# Altium project IOT_Masterv1.PrjPcb
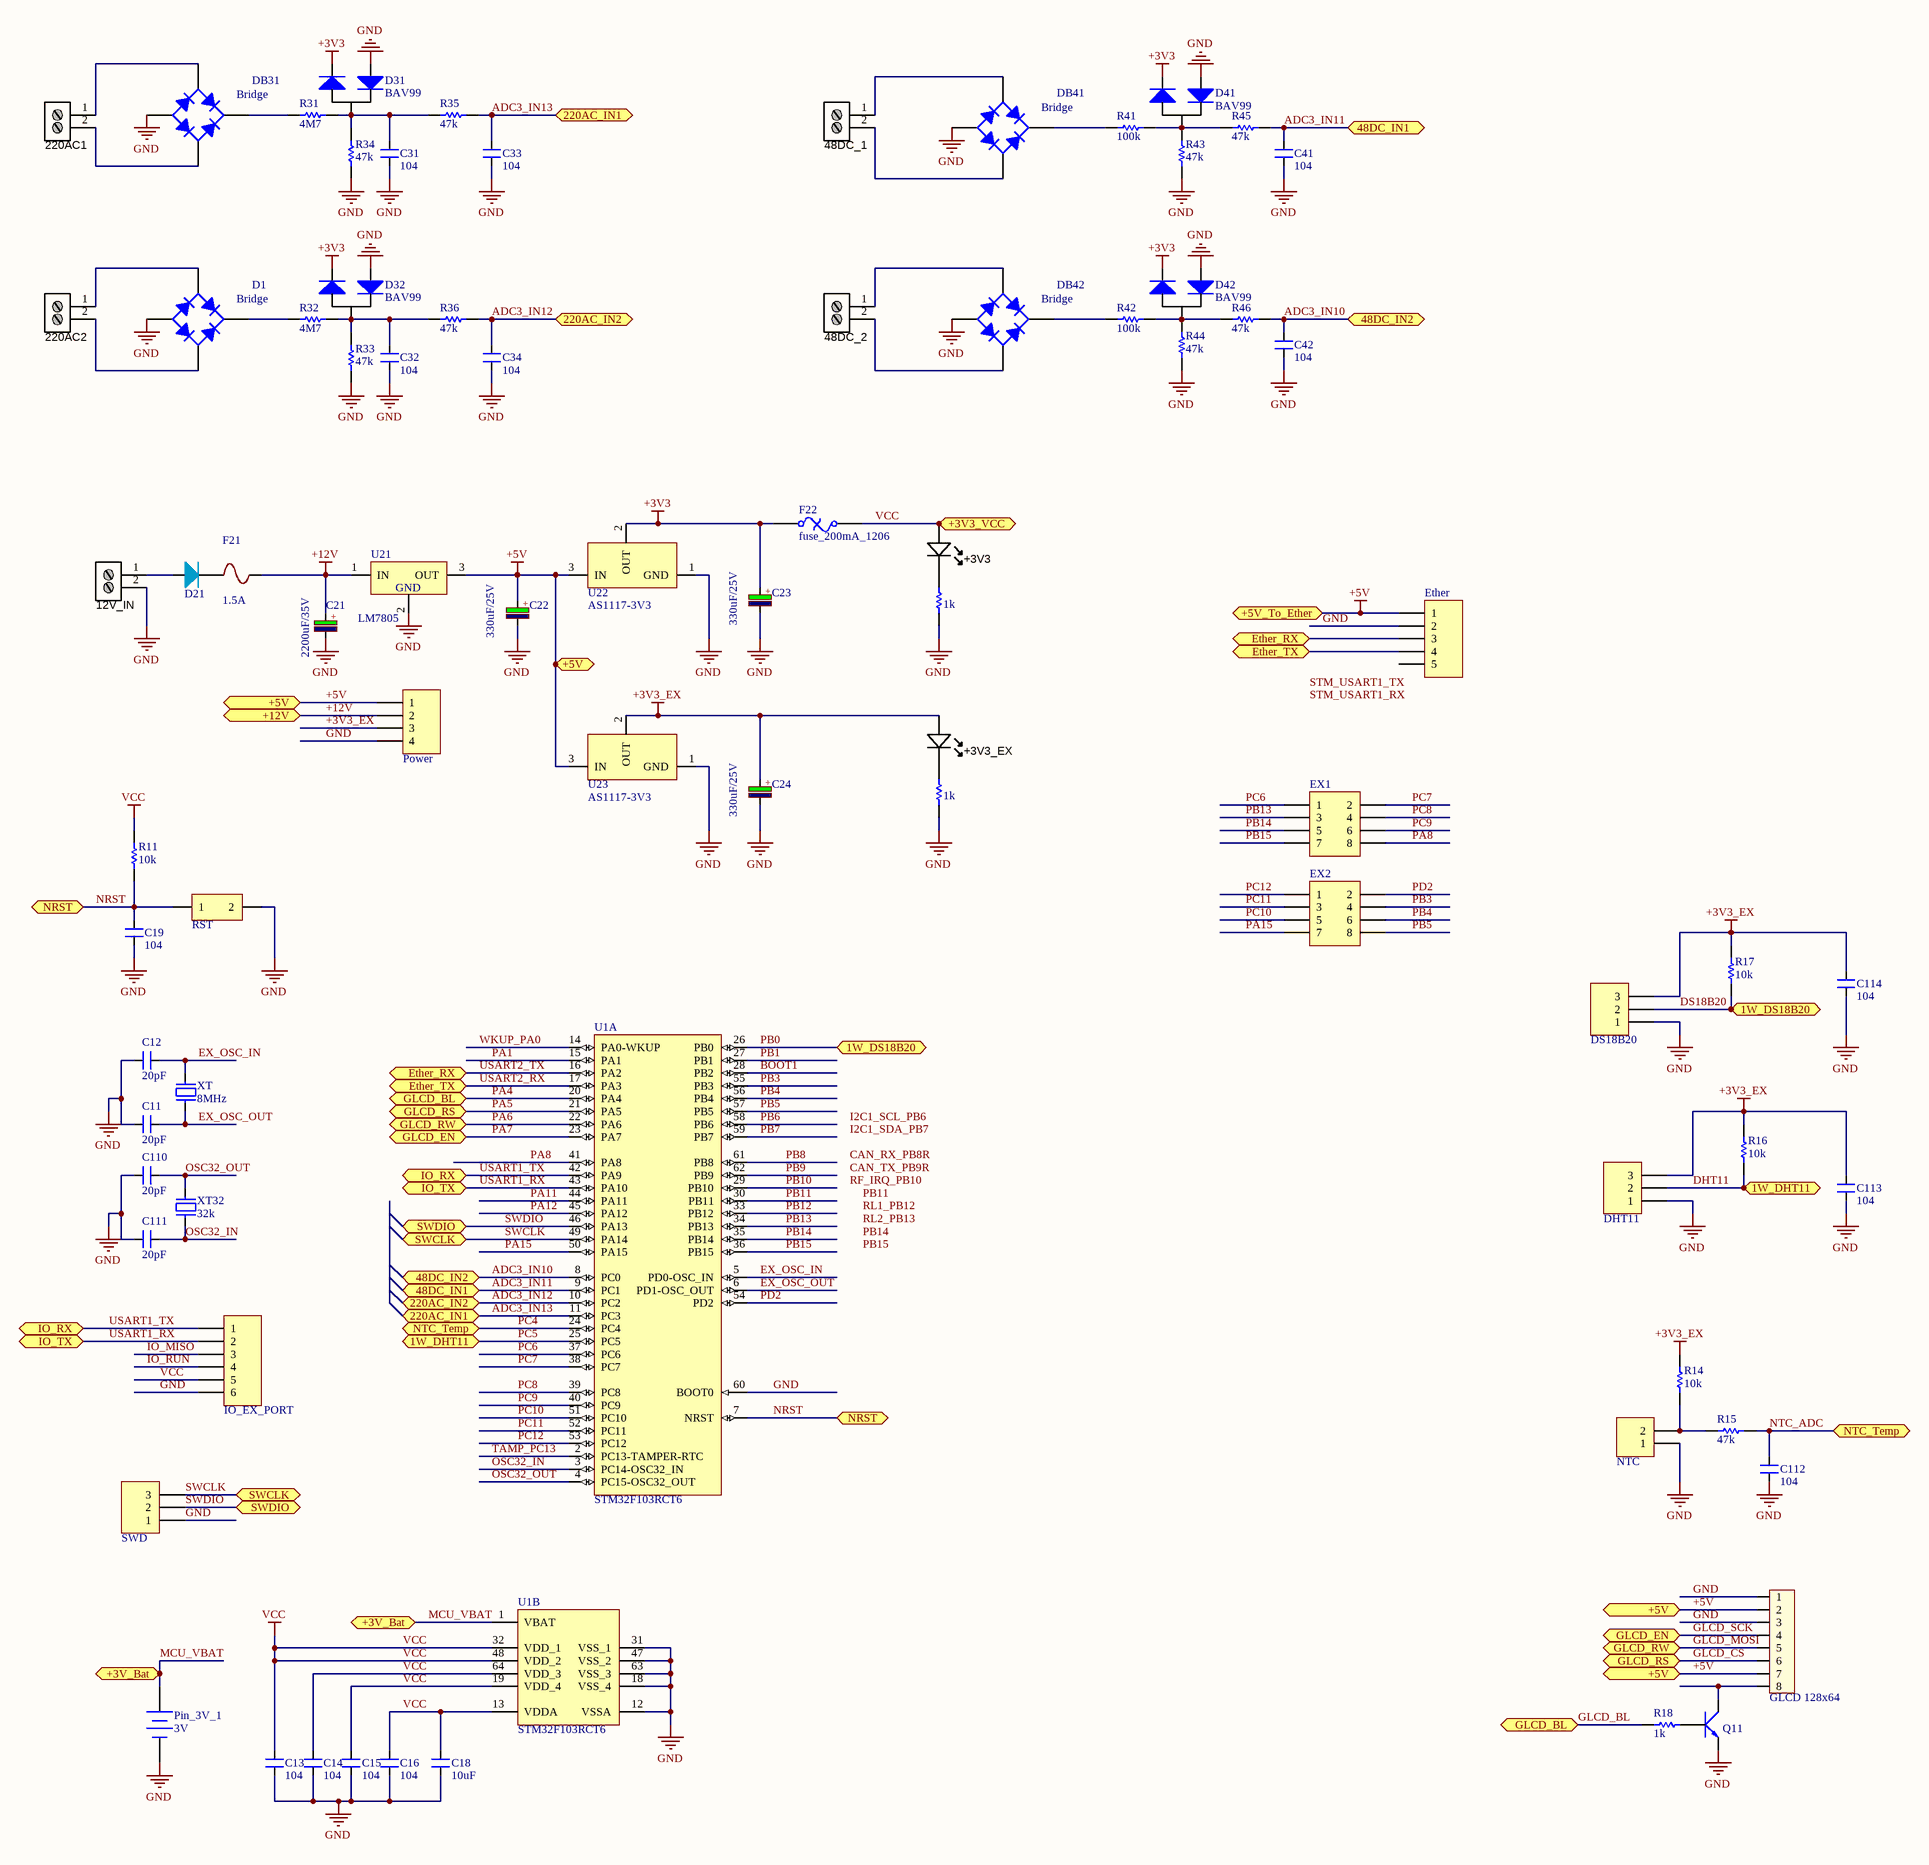
[diagram p0: IOT_Masterv1.SchDoc]
1 sheet, 80 parts. Net scope: flat (ports and power ports of the same name join across sheets).
Board file: IOT_Masterv1.PcbDoc

## Sheet IOT_Masterv1.SchDoc
size A2

### Parts
12V_IN  Stackable ScrewTerm  [2P_PCB_ScrewTerm_200mil]  (value not drawn)
48DC_1  Stackable ScrewTerm  [2P_PCB_ScrewTerm_200mil]  (value not drawn)
48DC_2  Stackable ScrewTerm  [2P_PCB_ScrewTerm_200mil]  (value not drawn)
220AC1  Stackable ScrewTerm  [2P_PCB_ScrewTerm_200mil]  (value not drawn)
220AC2  Stackable ScrewTerm  [2P_PCB_ScrewTerm_200mil]  (value not drawn)
+3V3  Blue  [LED-0805-K]  (value not drawn)
+3V3_EX  Blue  [LED-0805-K]  (value not drawn)
C11  value 20pF  [CAPC1608N]  (hidden comment: Cap_22p_0603)
C12  value 20pF  [CAPC1608N]  (hidden comment: Cap_22p_0603)
C13  value 104  [CAPC1608N]  (hidden comment: Cap_104_0603)
C14  value 104  [CAPC1608N]  (hidden comment: Cap_104_0603)
C15  value 104  [CAPC1608N]  (hidden comment: Cap_104_0603)
C16  value 104  [CAPC1608N]  (hidden comment: Cap_104_0603)
C18  value 10uF  [CAPC2012N_F]  (hidden comment: Cap_10uF_0805)
C19  value 104  [CAPC1608N]  (hidden comment: Cap_104_0603)
C21  2200uF/35V  [CP_1000uF_25V]
C22  330uF/25V  [CP1.5/3.4]
C23  330uF/25V  [CP1.5/3.4]
C24  330uF/25V  [CP1.5/3.4]
C31  value 104  [CAPC2012N_F]  (hidden comment: CAP NP)
C32  value 104  [CAPC2012N_F]  (hidden comment: CAP NP)
C33  value 104  [CAPC1608N]  (hidden comment: CAP NP)
C34  value 104  [CAPC1608N]  (hidden comment: CAP NP)
C41  value 104  [CAPC1608N]  (hidden comment: CAP NP)
C42  value 104  [CAPC1608N]  (hidden comment: CAP NP)
C110  value 20pF  [CAPC1608N]  (hidden comment: Cap_22p_0603)
C111  value 20pF  [CAPC1608N]  (hidden comment: Cap_22p_0603)
C112  value 104  [CAPC1608N]  (hidden comment: CAP NP)
C113  value 104  [CAPC1608N]  (hidden comment: CAP NP)
C114  value 104  [CAPC1608N]  (hidden comment: CAP NP)
D1  Bridge  [MB6S]
D21  Diode  [DO-214AC]  (value not drawn)
D31  BAV99  [SOT323]
D32  BAV99  [SOT323]
D41  BAV99  [SOT323]
D42  BAV99  [SOT323]
DB31  Bridge  [MB6S]
DB41  Bridge  [MB6S]
DB42  Bridge  [MB6S]
DHT11  Header 3  [HDR1X3]  (value not drawn)
DS18B20  Header 3  [HDR1X3]  (value not drawn)
Ether  EX_CON  [HDR1X5H]  (value not drawn)
EX1  Header 4X2  [HDR2X4]  (value not drawn)
EX2  Header 4X2  [HDR2X4]  (value not drawn)
F21  1.5A  [FUSE_SR-5-BK]
F22  fuse_200mA_1206  [SMD 1206]
GLCD_128x64  JP8  [CON8]  (value not drawn)
IO_EX_PORT  Header 6  [HDR1X6]  (value not drawn)
NTC  NTC_10K  [HDR1X2]  (value not drawn)
Pin_3V_1  3V  [CR1220]
Power  Header 4  [HDR1X4]  (value not drawn)
Q11  C828  [SOT23 TOP]  (value not drawn)
R11  value 10k  [RESC1608N_F]  (hidden comment: Res_10k_0603)
R14  value 10k  [RESC1608N_ZERO]  (hidden comment: Res)
R15  value 47k  [RESC2012N_F]  (hidden comment: Res)
R16  value 10k  [RESC1608N_ZERO]  (hidden comment: Res)
R17  value 10k  [RESC1608N_ZERO]  (hidden comment: Res)
R18  value 1k  [RESC1608N_ZERO]  (hidden comment: Res)
R21  value 1k  [RESC2012N_F]  (hidden comment: Res_0805_1k)
R22  value 1k  [RESC2012N_F]  (hidden comment: Res_0805_1k)
R31  value 4M7  [RESTH_0.0R_AXIAL-0.6]  (hidden comment: Res)
R32  value 4M7  [RESTH_0.0R_AXIAL-0.6]  (hidden comment: Res)
R33  value 47k  [RESTH_0.0R_AXIAL-0.6]  (hidden comment: Res)
R34  value 47k  [RESTH_0.0R_AXIAL-0.6]  (hidden comment: Res)
R35  value 47k  [RESC2012N_F]  (hidden comment: Res)
R36  value 47k  [RESC2012N_F]  (hidden comment: Res)
R41  value 100k  [RESTH_0.0R_AXIAL-0.6]  (hidden comment: Res)
R42  value 100k  [RESTH_0.0R_AXIAL-0.6]  (hidden comment: Res)
R43  value 47k  [RESTH_0.0R_AXIAL-0.6]  (hidden comment: Res)
R44  value 47k  [RESTH_0.0R_AXIAL-0.6]  (hidden comment: Res)
R45  value 47k  [RESC2012N_F]  (hidden comment: Res)
R46  value 47k  [RESC2012N_F]  (hidden comment: Res)
RST  Button  [SW]  (value not drawn)
SWD  Header 3  [HDR1X3]  (value not drawn)
U1  STM32F103RCT6  [STM-LQFP64_N]  (parts A,B of 2)
U21  LM7805  [TO-220]
U22  AS1117-3V3  [SOT223-4N]
U23  AS1117-3V3  [SOT223-4N]
XT  8MHz  [XT2]
XT32  32k  [XTminiv2]

### Ports
1W_DHT11, 1W_DS18B20, 48DC_IN1, 48DC_IN2, 220AC_IN1, 220AC_IN2, +3V3_VCC, +3V_Bat, +5V, +5V_To_Ether, +12V, Ether_RX, Ether_TX, GLCD_BL, GLCD_EN, GLCD_RS, GLCD_RW, IO_RX, IO_TX, NRST, NTC_Temp, SWCLK, SWDIO

### Nets
+3V3: C23.1 D31.2(K) D32.2(K) D41.2(K) D42.2(K) F22.1 U22.2(OUT)
+3V3_EX: +3V3_EX.A C24.1 C113.2 C114.2 DHT11.3 DS18B20.3 Power.3 R14.2 R16.2 R17.2 U23.2(OUT)
+5V: C22.1 Ether.1 GLCD_128x64.2 GLCD_128x64.7 Power.1 U21.3(OUT) U22.3(IN) U23.3(IN) ; port +5V, port +5V_To_Ether
+12V: C21.1 F21.2 Power.2 U21.1(IN) ; port +12V
GND: 12V_IN.2 C11.2 C12.2 C13.1 C14.1 C15.1 C16.1 C18.1 C19.1 C21.2 C22.2 C23.2 C24.2 C31.1 C32.1 C33.1 C34.1 C41.1 C42.1 C110.2 C111.2 C112.1 C113.1 C114.1 D1.3(A) D31.1(A) D32.1(A) D41.1(A) D42.1(A) DB31.3(A) DB41.3(A) DB42.3(A) DHT11.1 DS18B20.1 Ether.2 GLCD_128x64.1 GLCD_128x64.3 IO_EX_PORT.6 NTC.1 Pin_3V_1.2(-) Power.4 Q11.3(E) R21.2 R22.2 R33.1 R34.1 R43.1 R44.1 RST.2 SWD.1 U1.12(VSSA) U1.18(VSS_4) U1.31(VSS_1) U1.47(VSS_2) U1.60(BOOT0) U1.63(VSS_3) U21.2 U22.1(GND) U23.1(GND)
VCC: +3V3.A C13.2 C14.2 C15.2 C16.2 C18.2 F22.2 IO_EX_PORT.5 R11.2 U1.13(VDDA) U1.19(VDD_4) U1.32(VDD_1) U1.48(VDD_2) U1.64(VDD_3) ; port +3V3_VCC
ADC3_IN10: C42.2 R46.2 U1.8(PC0) ; port 48DC_IN2
ADC3_IN11: C41.2 R45.2 U1.9(PC1) ; port 48DC_IN1
ADC3_IN12: C34.2 R36.2 U1.10(PC2) ; port 220AC_IN2
ADC3_IN13: C33.2 R35.2 U1.11(PC3) ; port 220AC_IN1
BOOT1: U1.28(PB2)
DHT11: DHT11.2 R16.1 U1.25(PC5) ; port 1W_DHT11  [also labelled PC5]
DS18B20: DS18B20.2 R17.1 U1.26(PB0) ; port 1W_DS18B20  [also labelled PB0]
EX_OSC_IN: C12.1 U1.5(PD0-OSC_IN) XT.2
EX_OSC_OUT: C11.1 U1.6(PD1-OSC_OUT) XT.1
GLCD_BL: R18.1 U1.20(PA4) ; port GLCD_BL  [also labelled PA4]
GLCD_CS: GLCD_128x64.6 U1.21(PA5) ; port GLCD_RS  [also labelled PA5]
GLCD_MOSI: GLCD_128x64.5 U1.22(PA6) ; port GLCD_RW  [also labelled PA6]
GLCD_SCK: GLCD_128x64.4 U1.23(PA7) ; port GLCD_EN  [also labelled PA7]
IO_MISO: IO_EX_PORT.3
IO_RUN: IO_EX_PORT.4
MCU_VBAT: Pin_3V_1.1(+) U1.1(VBAT) ; port +3V_Bat
NRST: C19.2 R11.1 RST.1 U1.7(NRST) ; port NRST
NTC_ADC: C112.2 R15.2 U1.24(PC4) ; port NTC_Temp  [also labelled PC4]
OSC32_IN: C111.1 U1.3(PC14-OSC32_IN) XT32.1
OSC32_OUT: C110.1 U1.4(PC15-OSC32_OUT) XT32.2
PA1: U1.15(PA1)
PA8: EX1.8 U1.41(PA8)
PA11: U1.44(PA11)
PA12: U1.45(PA12)
PA15: EX2.7 U1.50(PA15)
PB1: U1.27(PB1)
PB3: EX2.4 U1.55(PB3)
PB4: EX2.6 U1.56(PB4)
PB5: EX2.8 U1.57(PB5)
PB6: U1.58(PB6)
PB7: U1.59(PB7)
PB8: U1.61(PB8)
PB9: U1.62(PB9)
PB10: U1.29(PB10)
PB11: U1.30(PB11)
PB12: U1.33(PB12)
PB13: EX1.3 U1.34(PB13)
PB14: EX1.5 U1.35(PB14)
PB15: EX1.7 U1.36(PB15)
PC6: EX1.1 U1.37(PC6)
PC7: EX1.2 U1.38(PC7)
PC8: EX1.4 U1.39(PC8)
PC9: EX1.6 U1.40(PC9)
PC10: EX2.5 U1.51(PC10)
PC11: EX2.3 U1.52(PC11)
PC12: EX2.1 U1.53(PC12)
PD2: EX2.2 U1.54(PD2)
SWCLK: SWD.3 U1.49(PA14) ; port SWCLK
SWDIO: SWD.2 U1.46(PA13) ; port SWDIO
TAMP_PC13: U1.2(PC13-TAMPER-RTC)
USART1_RX: IO_EX_PORT.2 U1.43(PA10) ; port IO_TX
USART1_TX: IO_EX_PORT.1 U1.42(PA9) ; port IO_RX
USART2_RX: Ether.4 U1.17(PA3) ; port Ether_TX
USART2_TX: Ether.3 U1.16(PA2) ; port Ether_RX
WKUP_PA0: U1.14(PA0-WKUP)
Net12V_IN_1: 12V_IN.1 D21.1(A)
Net48DC_1_1: 48DC_1.1 DB41.4(C)
Net48DC_1_2: 48DC_1.2 DB41.2(C)
Net48DC_2_1: 48DC_2.1 DB42.4(C)
Net48DC_2_2: 48DC_2.2 DB42.2(C)
Net220AC1_1: 220AC1.1 DB31.4(C)
Net220AC1_2: 220AC1.2 DB31.2(C)
Net220AC2_1: 220AC2.1 D1.4(C)
Net220AC2_2: 220AC2.2 D1.2(C)
Net+3V3_EX_K: +3V3_EX.K R22.1
Net+3V3_K: +3V3.K R21.1
NetC31_2: C31.2 D31.3(AK) R31.2 R34.2 R35.1
NetC32_2: C32.2 D32.3(AK) R32.2 R33.2 R36.1
NetD1_1: D1.1(K) R32.1
NetD21_2: D21.2(K) F21.1
NetD41_3: D41.3(AK) R41.2 R43.2 R45.1
NetD42_3: D42.3(AK) R42.2 R44.2 R46.1
NetDB31_1: DB31.1(K) R31.1
NetDB41_1: DB41.1(K) R41.1
NetDB42_1: DB42.1(K) R42.1
NetGLCD_128x64_8: GLCD_128x64.8 Q11.2(C)
NetNTC_2: NTC.2 R14.1 R15.1
NetQ11_1: Q11.1(B) R18.2

Not connected (* = marked no-connect by the designer): Ether 5

### Notes on the sheet
- Labels drawn without touching a wire or pin: CAN_RX_PB8R, CAN_TX_PB9R, I2C1_SCL_PB6, I2C1_SDA_PB7, PB11, PB14, PB15, RF_IRQ_PB10, RL1_PB12, RL2_PB13, STM_USART1_RX, STM_USART1_TX
- (in symbol CP4) +
- (in symbol LM78xx) GND

### Library data of the parts
12V_IN 48DC_1 48DC_2 220AC1 220AC2 = 2P_ScrewTerm_90S_3.81MM: Terminal Block Screw Type THT 2-Position 3.81mm pitch; Manufacturer 1: Tyco Electronics; Manufacturer Part Number 1: 1776113-2; Value: 2 position; Pitch: 0.150" (3.81mm); Positions Per Level: 2; Package / Case: Side Entry; 3.81mm pitch; Category: Connectors Interconnects; Color: Black; Supplier 1: Digi-Key; Supplier Part Number 1: A97976-ND
+3V3 +3V3_EX = LED_SMD_Blue_0805_100mcd: LED 0805 SMD Blue 100mcd 470nm; Manufacturer 1: Ligitek; Manufacturer Part Number 1: LG-170DBKZ-CT; Ratings: 100 mcd; 470 nm; Package / Case: 0805; Material: InGaN/GaN; Value: Blue; Color: Blue
C11-C16 C18 C19 C110 C111 = CAP NP
C21-C24 = CP4: Cap 1000uF/16V - 220uF/50V; Description 5: 4,7uF>10uF/250V_3,3uF>10uF/400V - 2,2uF>4,7uF/450V; Description 1: 2200uF-3300uF/6,3V - 1000uF-2200uF/10V; Description 2: 1000uF/16V - 470uF => 1000uF/25V - 100uF/100V; Description 3: 330uF>470uF/35V_220uF>470uF/50V_10uF>22uF/250V; Description 4: 220uF => 330uF/63V - 10uF =>33uF/160 - 200V; Value: 1000uF/16V
D1 DB31 DB41 DB42 = Bridge1: Full Wave Diode Bridge; pin to pad: 2>3 3>4 4>2; Published: 8-Jun-2000; LatestRevisionDate: 29-May-2009; LatestRevisionNote: Sch pins A & K swapped.; DatasheetVersion: E2732B; PackageReference: D-38; Publisher: Altium Limited; PackageDescription: Bridge Rectifier; 4 Terminals; Body 9.4 x 9.4 mm (typ); Pitch 5.08 mm
D21 = Diode: pin to pad: 1>A 2>K
D31 D32 D41 D42 = BAV99W
DHT11 DS18B20 SWD = Header 3: Header, 3-Pin; LatestRevisionDate: 17-Jul-2002; LatestRevisionNote: Re-released for DXP Platform.; Publisher: Altium Limited
Ether = Header 5H: Header, 5-Pin, Right Angle; LatestRevisionDate: 17-Jul-2002; LatestRevisionNote: Re-released for DXP Platform.; Publisher: Altium Limited
EX1 EX2 = Header 4X2: Header, 4-Pin, Dual row; LatestRevisionDate: 17-Jul-2002; LatestRevisionNote: Re-released for DXP Platform.; Publisher: Altium Limited
F21 = Fuse
F22 = Fuse Thermal: Thermal Fuse; Published: 24-Mar-1999; LatestRevisionDate: 17-Jul-2002; LatestRevisionNote: Re-released for DXP Platform.; PackageReference: PIN-W2/E2.8; Publisher: Altium Limited; PackageDescription: Thru-Hole; 2 Leads
GLCD_128x64 = Con8: Connector 8; Value: Connector 8
IO_EX_PORT = Header 6: Header, 6-Pin; LatestRevisionDate: 17-Jul-2002; LatestRevisionNote: Re-released for DXP Platform.; Publisher: Altium Limited
NTC = Header 2: Header, 2-Pin; LatestRevisionDate: 17-Jul-2002; LatestRevisionNote: Re-released for DXP Platform.; Publisher: Altium Limited
Pin_3V_1 = Battery: Multicell Battery; Published: 24-Mar-1999; LatestRevisionDate: 17-Jul-2002; LatestRevisionNote: Re-released for DXP Platform.; PackageReference: BAT-2; Publisher: Altium Limited
Power = Header 4: Header, 4-Pin; LatestRevisionDate: 17-Jul-2002; LatestRevisionNote: Re-released for DXP Platform.; Publisher: Altium Limited
Q11 = NPN: Transistor C828 C1815....
R11 R21 R22 = Res
RST = Button I
U1 = STM32F103RCT6: ARM Cortex-M3 32-bit MCU, 256 KB Flash, 48 KB Internal RAM, 51 I/Os, 64-pin LQFP, -40 to 85 degC, Tray; A/D Converter: 3x12-bit (16 Channel); D/A Converter: 2x12-bit (2 Channel); FLASH Size (Prog) (kB): 256; I/Os (High Current): 51; Internal RAM Size (kB): 48; Operating Frequency(F) (Processor speed) (MHz): 72; Supply Voltage(Vcc) min (V): 2; DatasheetVersion: Rev. 8; PackageVersion: Rev. 4, 06/2013; PackageReference: LQFP64; PackageDescription: 64-Pin Low Profile Quad Flat Package, 10 x 10 mm Body, 0.5 mm Pitch; Supplier 1: Digi-Key; Supplier Part Number 1: 497-9033-ND; Supplier 2: Newark; Supplier Part Number 2: 01P4099; Supplier 3: Newark; Supplier Part Number 3: 57P1227; Supplier 4: Mouser; Supplier Part Number 4: 511-STM32F103RCT6; Core: ARM Cortex-M3; Packing: Tray; Mounting Technology: Surface Mount; PartNumber: STM32F103RCT6; ComponentLink1Description: Manufacturer URL; ComponentLink1URL: http://www.st.com/web/en/home.html; ComponentLink2Description: Datasheet; ComponentLink2URL: http://www.st.com/st-web-ui/static/active/en/resource/technical/document/datasheet/CD00191185.pdf; ComponentLink3Description: Package Specification; ComponentLink3URL: http://www.st.com/st-web-ui/static/active/en/resource/technical/document/datasheet/DM00037051.pdf
U21 = LM78xx
U22 U23 = AS1117: pin to pad: 2>2+4
XT XT32 = Crystal